# Altium schematic sheet Sheet_1.schdoc
size 446 x 173 mm
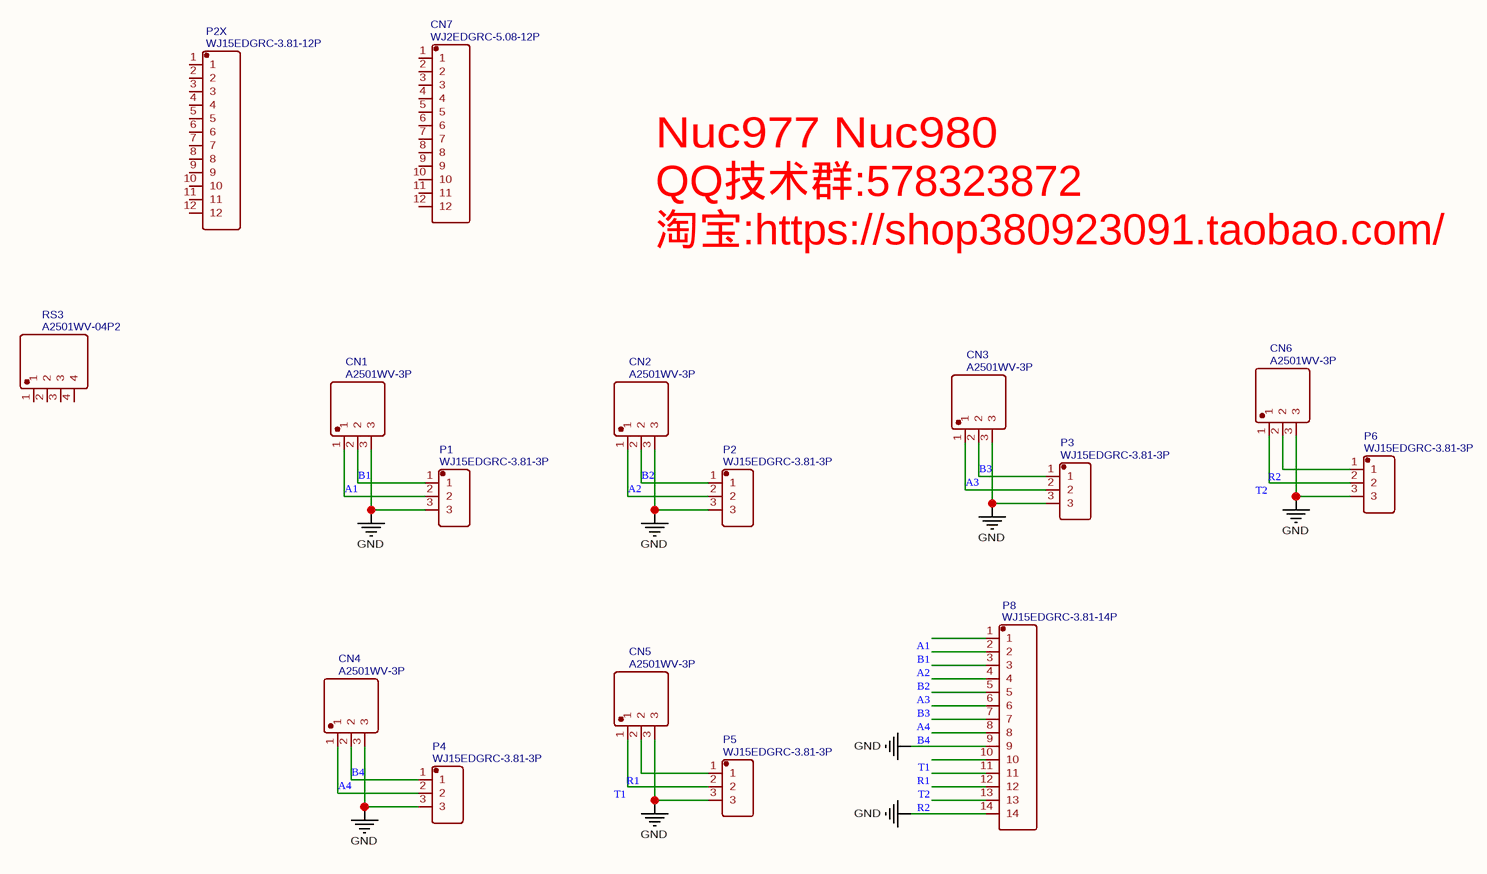
[diagram p0: Sheet_1.schdoc]

## Parts
CN1  A2501WV-3P  [A2501WV-3P]
CN2  A2501WV-3P  [A2501WV-3P]
CN3  A2501WV-3P  [A2501WV-3P]
CN4  A2501WV-3P  [A2501WV-3P]
CN5  A2501WV-3P  [A2501WV-3P]
CN6  A2501WV-3P  [A2501WV-3P]
CN7  WJ2EDGRC-5.08-12P  [WJ2EDGRC-5.08-12P]
P1  WJ15EDGRC-3.81-3P  [WJ15EDGRC-3.81-3P]
P2  WJ15EDGRC-3.81-3P  [WJ15EDGRC-3.81-3P]
P2X  WJ15EDGRC-3.81-12P  [WJ15EDGRC-3.81-12P]
P3  WJ15EDGRC-3.81-3P  [WJ15EDGRC-3.81-3P]
P4  WJ15EDGRC-3.81-3P  [WJ15EDGRC-3.81-3P]
P5  WJ15EDGRC-3.81-3P  [WJ15EDGRC-3.81-3P]
P6  WJ15EDGRC-3.81-3P  [WJ15EDGRC-3.81-3P]
P8  WJ15EDGRC-3.81-14P  [WJ15EDGRC-3.81-14P]
RS3  A2501WV-04P2  [A2501WV-4P]

## Nets
GND: CN1.3 CN2.3 CN3.3 CN4.3 CN5.3 CN6.3 P1.3 P2.3 P3.3 P4.3 P5.3 P6.3 P8.9 P8.14
A1: CN1.1 P1.2 P8.1
A2: CN2.1 P2.2 P8.3
A3: CN3.1 P3.2 P8.5
A4: CN4.1 P4.2 P8.7
B1: CN1.2 P1.1 P8.2
B2: CN2.2 P2.1 P8.4
B3: CN3.2 P3.1 P8.6
B4: CN4.2 P4.1 P8.8
R1: CN5.2 P5.1 P8.11
R2: CN6.2 P6.1 P8.13
T1: CN5.1 P5.2 P8.10
T2: CN6.1 P6.2 P8.12

Not connected (* = marked no-connect by the designer): CN7 1 2 3 4 5 6 7 8 9 10 11 12; P2X 1 2 3 4 5 6 7 8 9 10 11 12; RS3 1 2 3 4

## Notes on the sheet
- Nuc977 Nuc980
  QQ技术群:578323872
  淘宝:https://shop380923091.taobao.com/

## Library data of the parts
CN1-CN6 = A2501WV-3P: BOM_Manufacturer: Changjiang Connectors; Contributor: LCSC; BOM_Supplier: LCSC; BOM_Supplier Part: C225389; BOM_Manufacturer Part: A2501WV-3P; spicePre: C
CN7 = WJ2EDGRC-5.08-12P: BOM_Manufacturer: ReliaPro; Contributor: LCSC; BOM_Supplier: LCSC; BOM_Manufacturer Part: WJ2EDGRC-5.08-12P; BOM_Supplier Part: C127848; spicePre: C
P1-P6 = WJ15EDGRC-3.81-3P: BOM_Manufacturer: ReliaPro; spicePre: X; BOM_Supplier: LCSC; BOM_Manufacturer Part: WJ15EDGRC-3.81-3P; image: //image.lceda.cn/szlcsc/C8406.jpg; BOM_Supplier Part: C8406
P2X = WJ15EDGRC-3.81-12P: BOM_Manufacturer: ReliaPro; spicePre: X; BOM_Supplier: LCSC; BOM_Manufacturer Part: WJ15EDGRC-3.81-12P; image: //image.lceda.cn/szlcsc/C35591.jpg; BOM_Supplier Part: C35591
P8 = WJ15EDGRC-3.81-14P: BOM_Manufacturer: ReliaPro; spicePre: X; BOM_Supplier: LCSC; BOM_Manufacturer Part: WJ15EDGRC-3.81-14P; image: //image.lceda.cn/szlcsc/C31933.jpg; BOM_Supplier Part: C31933
RS3 = A2501WV-04P2: BOM_Manufacturer: Joint Tech Elec; Contributor: LCSC; BOM_Supplier: LCSC; BOM_Supplier Part: C352914; BOM_Manufacturer Part: A2501WV-04P2; spicePre: U